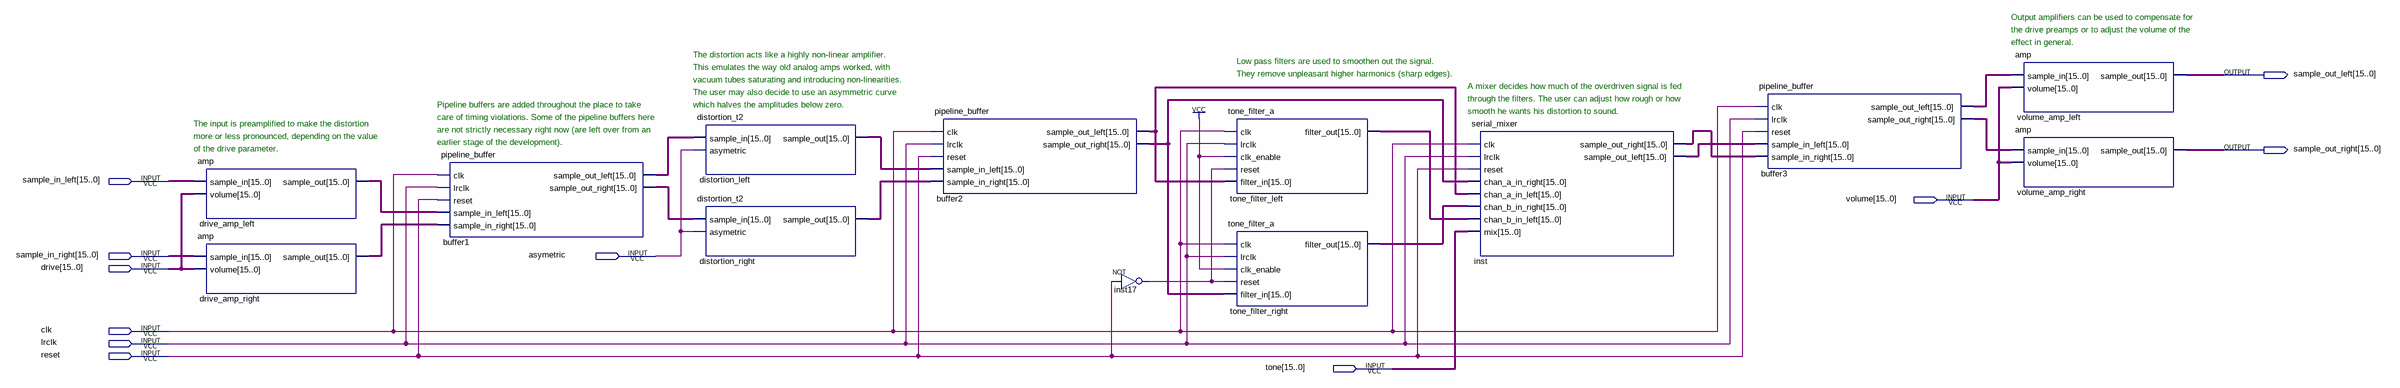
[diagram p0: schematic sheet]
// Quartus schematic distortion_block.bdf as structural Verilog: 13 symbols, 11 pins
module distortion_block (
  input  [15:0] sample_in_left,
  input  [15:0] volume,
  input  [15:0] sample_in_right,
  input  asymetric,
  input  [15:0] drive,
  input  clk,
  input  lrclk,
  input  reset,
  input  [15:0] tone,
  output [15:0] sample_out_left,
  output [15:0] sample_out_right
);

  wire inst17_out;
  wire [15:0] buffer1_sample_out_left, buffer1_sample_out_right, buffer2_sample_out_left,
       buffer2_sample_out_right, buffer3_sample_out_left, buffer3_sample_out_right,
       distortion_left_sample_out, distortion_right_sample_out, drive_amp_left_sample_out,
       drive_amp_right_sample_out, inst_sample_out_left, inst_sample_out_right, tone_filter_left_filter_out,
       tone_filter_right_filter_out;

  amp drive_amp_left (.sample_in(sample_in_left), .volume(drive), .sample_out(drive_amp_left_sample_out));
  amp drive_amp_right (.sample_in(sample_in_right), .volume(drive), .sample_out(drive_amp_right_sample_out));
  pipeline_buffer buffer1 (
    .clk(clk), .lrclk(lrclk), .reset(reset), .sample_in_left(drive_amp_left_sample_out),
    .sample_in_right(drive_amp_right_sample_out), .sample_out_left(buffer1_sample_out_left),
    .sample_out_right(buffer1_sample_out_right));
  distortion_t2 distortion_left (
    .sample_in(buffer1_sample_out_left), .asymetric(asymetric), .sample_out(distortion_left_sample_out));
  distortion_t2 distortion_right (
    .sample_in(buffer1_sample_out_right), .asymetric(asymetric), .sample_out(distortion_right_sample_out));
  pipeline_buffer buffer2 (
    .clk(clk), .lrclk(lrclk), .reset(reset), .sample_in_left(distortion_left_sample_out),
    .sample_in_right(distortion_right_sample_out), .sample_out_left(buffer2_sample_out_left),
    .sample_out_right(buffer2_sample_out_right));
  not inst17 (inst17_out, reset);
  tone_filter_a tone_filter_left (
    .clk(clk), .lrclk(lrclk), .clk_enable(1'b1), .reset(inst17_out), .filter_in(buffer2_sample_out_left),
    .filter_out(tone_filter_left_filter_out));
  tone_filter_a tone_filter_right (
    .clk(clk), .lrclk(lrclk), .clk_enable(1'b1), .reset(inst17_out), .filter_in(buffer2_sample_out_right),
    .filter_out(tone_filter_right_filter_out));
  serial_mixer inst (
    .clk(clk), .lrclk(lrclk), .reset(reset), .chan_a_in_right(buffer2_sample_out_right),
    .chan_a_in_left(buffer2_sample_out_left), .chan_b_in_right(tone_filter_right_filter_out),
    .chan_b_in_left(tone_filter_left_filter_out), .mix(tone), .sample_out_right(inst_sample_out_right),
    .sample_out_left(inst_sample_out_left));
  pipeline_buffer buffer3 (
    .clk(clk), .lrclk(lrclk), .reset(reset), .sample_in_left(inst_sample_out_left),
    .sample_in_right(inst_sample_out_right), .sample_out_left(buffer3_sample_out_left),
    .sample_out_right(buffer3_sample_out_right));
  amp volume_amp_left (.sample_in(buffer3_sample_out_left), .volume(volume), .sample_out(sample_out_left));
  amp volume_amp_right (.sample_in(buffer3_sample_out_right), .volume(volume), .sample_out(sample_out_right));

  // Notes on the sheet:
  //   Output amplifiers can be used to compensate for
  //   the drive preamps or to adjust the volume of the
  //   effect in general.
  //   The distortion acts like a highly non-linear amplifier.
  //   Low pass filters are used to smoothen out the signal.
  //   This emulates the way old analog amps worked, with
  //   They remove unpleasant higher harmonics (sharp edges).
  //   vacuum tubes saturating and introducing non-linearities.
  //   A mixer decides how much of the overdriven signal is fed
  //   The user may also decide to use an asymmetric curve
  //   through the filters. The user can adjust how rough or how
  //   Pipeline buffers are added throughout the place to take
  //   which halves the amplitudes below zero.
  //   smooth he wants his distortion to sound.
  //   care of timing violations. Some of the pipeline buffers here
  //   The input is preamplified to make the distortion
  //   are not strictly necessary right now (are left over from an
  //   more or less pronounced, depending on the value
  //   earlier stage of the development).
  //   of the drive parameter.
endmodule
